# EAGLE design Serial_final_rev01 (EAGLE 9.6.0)
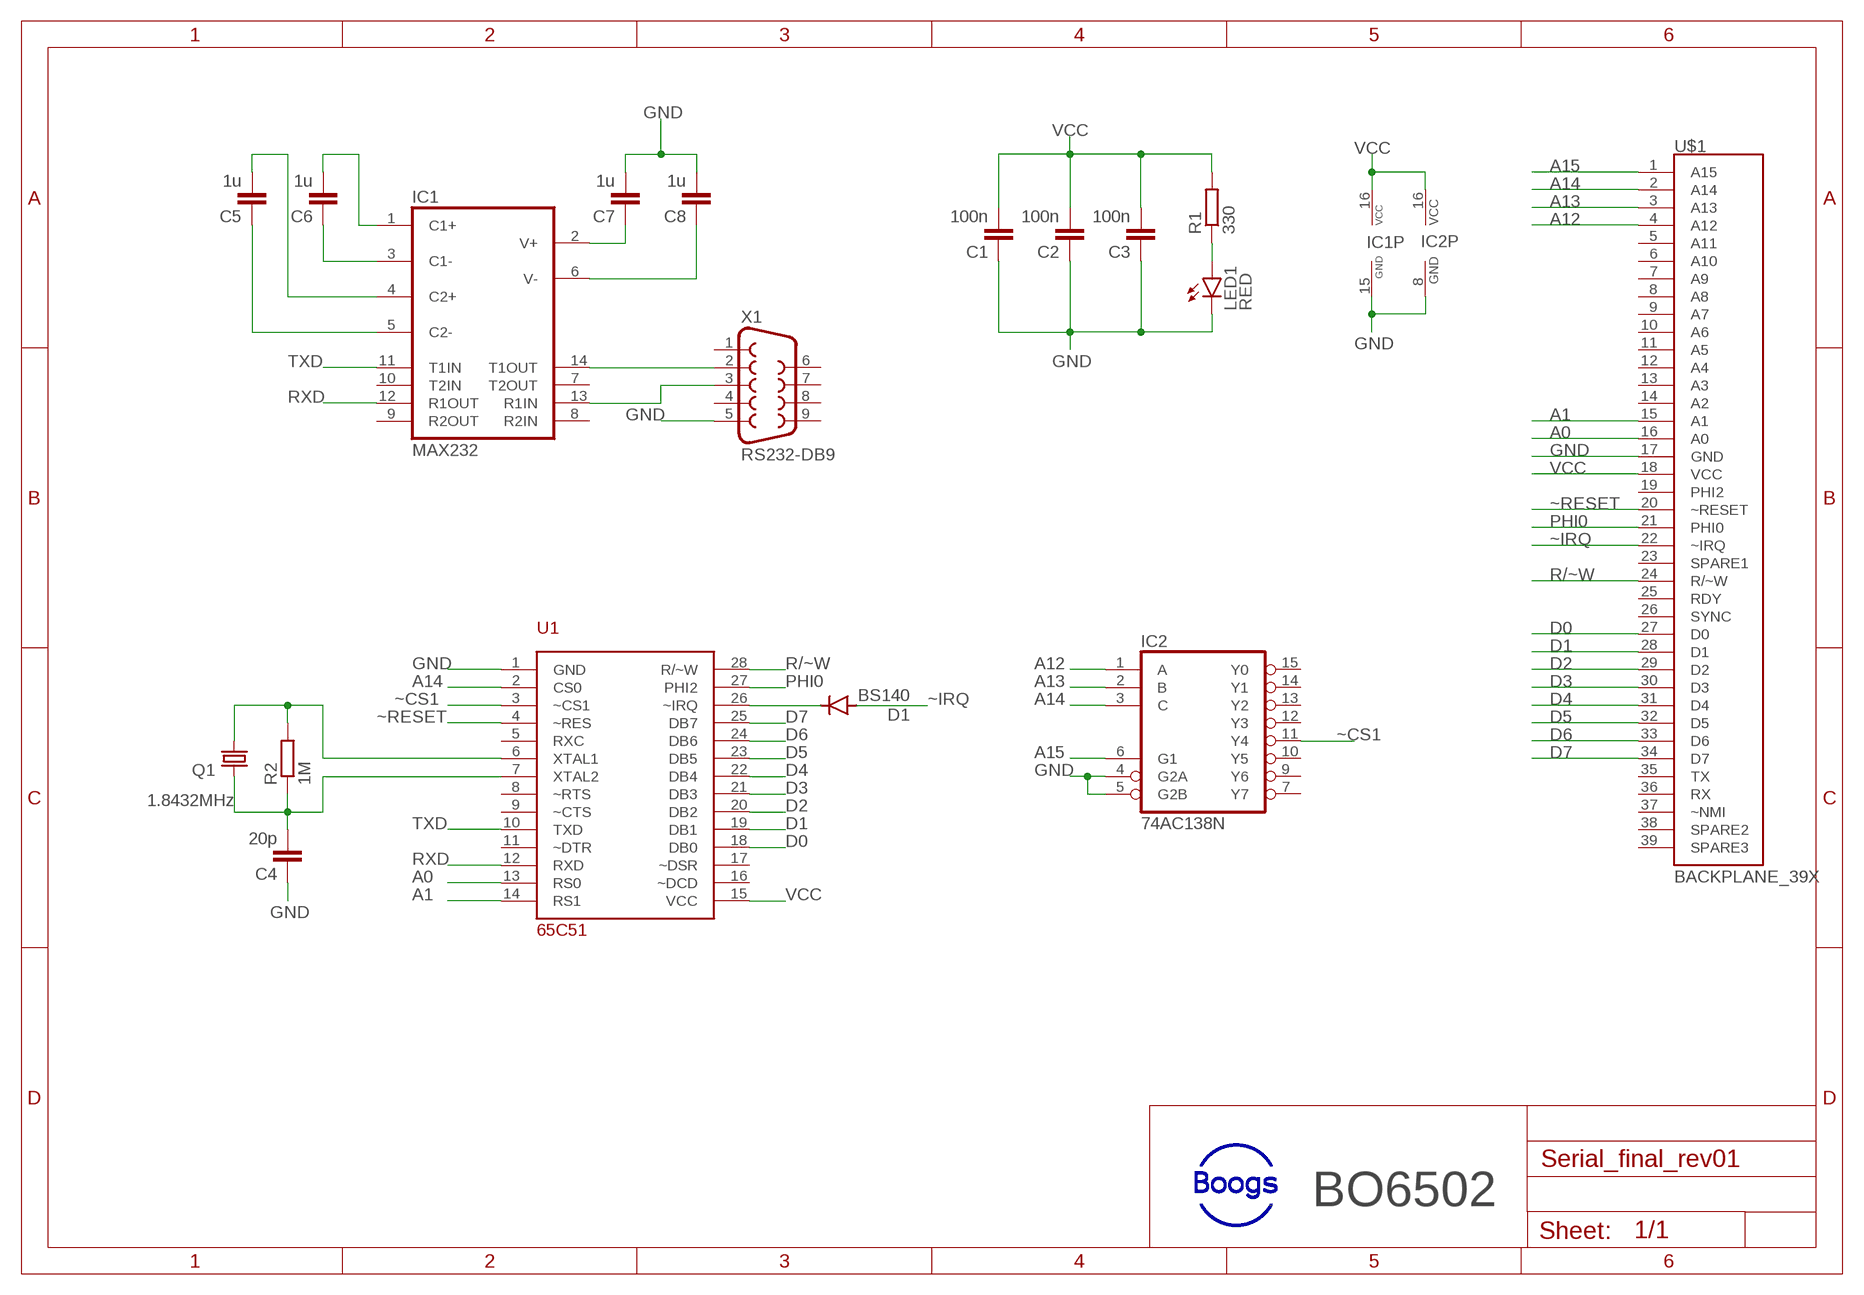
[diagram p0: schematic, sheet 1]

## Parts
C1  100n  C-EU025-025X050  [C025-025X050]
C2  100n  C-EU025-025X050  [C025-025X050]
C3  100n  C-EU025-025X050  [C025-025X050]
C4  20p  C-EU025-025X050  [C025-025X050]
C5  1u  C-EU050-025X075  [C050-025X075]
C6  1u  C-EU050-025X075  [C050-025X075]
C7  1u  C-EU050-025X075  [C050-025X075]
C8  1u  C-EU050-025X075  [C050-025X075]
D1  BS140  1N4004  [DO41-10]
IC1  MAX232  [DIL16]
IC2  74AC138N  [DIL16]
LED1  RED  LED5MM  [LED5MM]
Q1  1.8432MHz  CRYSTALHC49S  [HC49/S]
R1  330  R-EU_0207/10  [0207/10]
R2  1M  R-EU_0207/10  [0207/10]
U1  65C51  [DIL28]
U$1  BACKPLANE_39X  [BP_39X]
X1  RS232-DB9  F09HP  [F09HP]

## Nets
A0: U1.13(RS0) U$1.16(A0)
A1: U1.14(RS1) U$1.15(A1)
A12: IC2.1(A) U$1.4(A12)
A13: IC2.2(B) U$1.3(A13)
A14: IC2.3(C) U1.2(CS0) U$1.2(A14)
A15: IC2.6(G1) U$1.1(A15)
D0: U1.18(DB0) U$1.27(D0)
D1: U1.19(DB1) U$1.28(D1)
D2: U1.20(DB2) U$1.29(D2)
D3: U1.21(DB3) U$1.30(D3)
D4: U1.22(DB4) U$1.31(D4)
D5: U1.23(DB5) U$1.32(D5)
D6: U1.24(DB6) U$1.33(D6)
D7: U1.25(DB7) U$1.34(D7)
GND: C1.1 C2.1 C3.1 C4.1 C7.2 C8.2 IC1.15(GND) IC2.4(G2A) IC2.5(G2B) IC2.8(GND) LED1.K(C) U1.1(GND) U$1.17(GND) X1.5
N$1: C6.2 IC1.1(C1+)
N$2: D1.C U1.26(~IRQ)
N$3: C6.1 IC1.3(C1-)
N$4: C5.2 IC1.4(C2+)
N$5: C5.1 IC1.5(C2-)
N$6: LED1.A R1.1
N$7: IC1.14(T1OUT) X1.2
N$8: IC1.13(R1IN) X1.3
N$9: C7.1 IC1.2(V+)
N$10: C8.1 IC1.6(V-)
N$11: Q1.2 R2.2 U1.6(XTAL1)
N$12: C4.2 Q1.1 R2.1 U1.7(XTAL2)
PHI0: U1.27(PHI2) U$1.21(PHI0)
R/~W: U1.28(R/~W) U$1.24(R/~W)
RXD: IC1.12(R1OUT) U1.12(RXD)
TXD: IC1.11(T1IN) U1.10(TXD)
VCC: C1.2 C2.2 C3.2 IC1.16(VCC) IC2.16(VCC) R1.2 U1.15(VCC) U$1.18(VCC)
~CS1: IC2.11(Y4) U1.3(~CS1)
~IRQ: D1.A U$1.22(~IRQ)
~RESET: U1.4(~RES) U$1.20(~RESET)
Unconnected: IC1.7(T2OUT) IC1.8(R2IN) IC1.9(R2OUT) IC1.10(T2IN) IC2.7(Y7) IC2.9(Y6) IC2.10(Y5) IC2.12(Y3) IC2.13(Y2) IC2.14(Y1) IC2.15(Y0) U1.5(RXC) U1.8(~RTS) U1.9(~CTS) U1.11(~DTR) U1.16(~DCD) U1.17(~DSR) U$1.5(A11) U$1.6(A10) U$1.7(A9) U$1.8(A8) U$1.9(A7) U$1.10(A6) U$1.11(A5) U$1.12(A4) U$1.13(A3) U$1.14(A2) U$1.19(PHI2) U$1.23(SPARE1) U$1.25(RDY) U$1.26(SYNC) U$1.35(TX) U$1.36(RX) U$1.37(~NMI) U$1.38(SPARE2) U$1.39(SPARE3) X1.1 X1.4 X1.6 X1.7 X1.8 X1.9

## Notes on the sheet
- BO6502

## Library data of the parts
C1-C8 = rcl:C-EU: CAPACITOR, European symbol; SPICEPREFIX: C
D1 = diode:1N4004: DIODE general purpose rectifier, 1 A
IC1 = maxim:MAX232: RS232 TRANSCEIVER; MF: MAXIM; MPN: MAX232ACPE+; OC_FARNELL: 9723773; OC_NEWARK: 68K4544
IC2 = 74xx-eu:74*138: 3-line to 8-line DECODER/DEMULTIPLEXER
LED1 = led:LED: LED OSRAM: - CHIPLED LG R971, LG N971, LY N971, LG Q971, LY Q971, LO R971, LY R971 LH N974, LH R974 LS Q976, LO Q976, LY Q976 LO Q996 - Hyper CHIPLED LW Q18S LB Q993, LB Q99A, LB R99A - SideLED LS A670, LO A670, LY A670, LG A670, LP A670 LB A673, LV A673, LT A673, LW A673 LH A674 LY A675 LS A676, LA A676, LO A676, LY A676, LW A676 LS A679, LY A679, LG A679 - Hyper Micro SIDELED® LS Y876, LA Y876, LO Y876, LY Y876 LT Y87S - SmartLED LW L88C, LW L88S LB L89C, LB L89S, LG L890 LS L89K, LO L89K, LY L89K LS L896, LA L896, LO L896, LY L896 - TOPLED LS T670, LO T670, LY T670, LG T670, LP T670 LSG T670, LSP T670, LSY T670, LOP T670, LYG T670 LG T671, LOG T671, LSG T671 LB T673, LV T673, LT T673, LW T673 LH T674 LS T676, LA T676, LO T676, LY T676, LB T676, LH T676, LSB T676, LW T676 LB T67C, LV T67C, LT T67C, LS T67K, LO T67K, LY T67K, LW E67C LS E67B, LA E67B, LO E67B, LY E67B, LB E67C, LV E67C, LT E67C LW T67C LS T679, LY T679, LG T679 LS T770, LO T770, LY T770, LG T770, LP T770 LB T773, LV T773, LT T773, LW T773 LH T774 LS E675, LA E675, LY E675, LS T675 LS T776, LA T776, LO T776, LY T776, LB T776 LHGB T686 LT T68C, LB T68C - Hyper Mini TOPLED® LB M676 - Mini TOPLED Santana® LG M470 LS M47K, LO M47K, LY M47K Source: http://www.osram.convergy.de LUXEON: - LUMILED® LXK2-PW12-R00, LXK2-PW12-S00, LXK2-PW14-U00, LXK2-PW14-V00 LXK2-PM12-R00, LXK2-PM12-S00, LXK2-PM14-U00 LXK2-PE12-Q00, LXK2-PE12-R00, LXK2-PE12-S00, LXK2-PE14-T00, LXK2-PE14-U00 LXK2-PB12-K00, LXK2-PB12-L00, LXK2-PB12-M00, LXK2-PB14-N00, LXK2-PB14-P00, LXK2-PB14-Q00 LXK2-PR12-L00, LXK2-PR12-M00, LXK2-PR14-Q00, LXK2-PR14-R00 LXK2-PD12-Q00, LXK2-PD12-R00, LXK2-PD12-S00 LXK2-PH12-R00, LXK2-PH12-S00 LXK2-PL12-P00, LXK2-PL12-Q00, LXK2-PL12-R00 Source: www.luxeon.com KINGBRIGHT: KA-3528ASYC Source: www.kingbright.com
Q1 = crystal:CRYSTAL: CRYSTAL; OC_FARNELL: 1667008; OC_NEWARK: unknown
R1 R2 = rcl:R-EU_: RESISTOR, European symbol; SPICEPREFIX: R
U1 = 65xx_family:65C51
U$1 = 65xx_family:BACKPLANE_39X; A15: A15
X1 = con-subd:F09: SUB-D; OC_FARNELL: unknown; OC_NEWARK: unknown

## Board
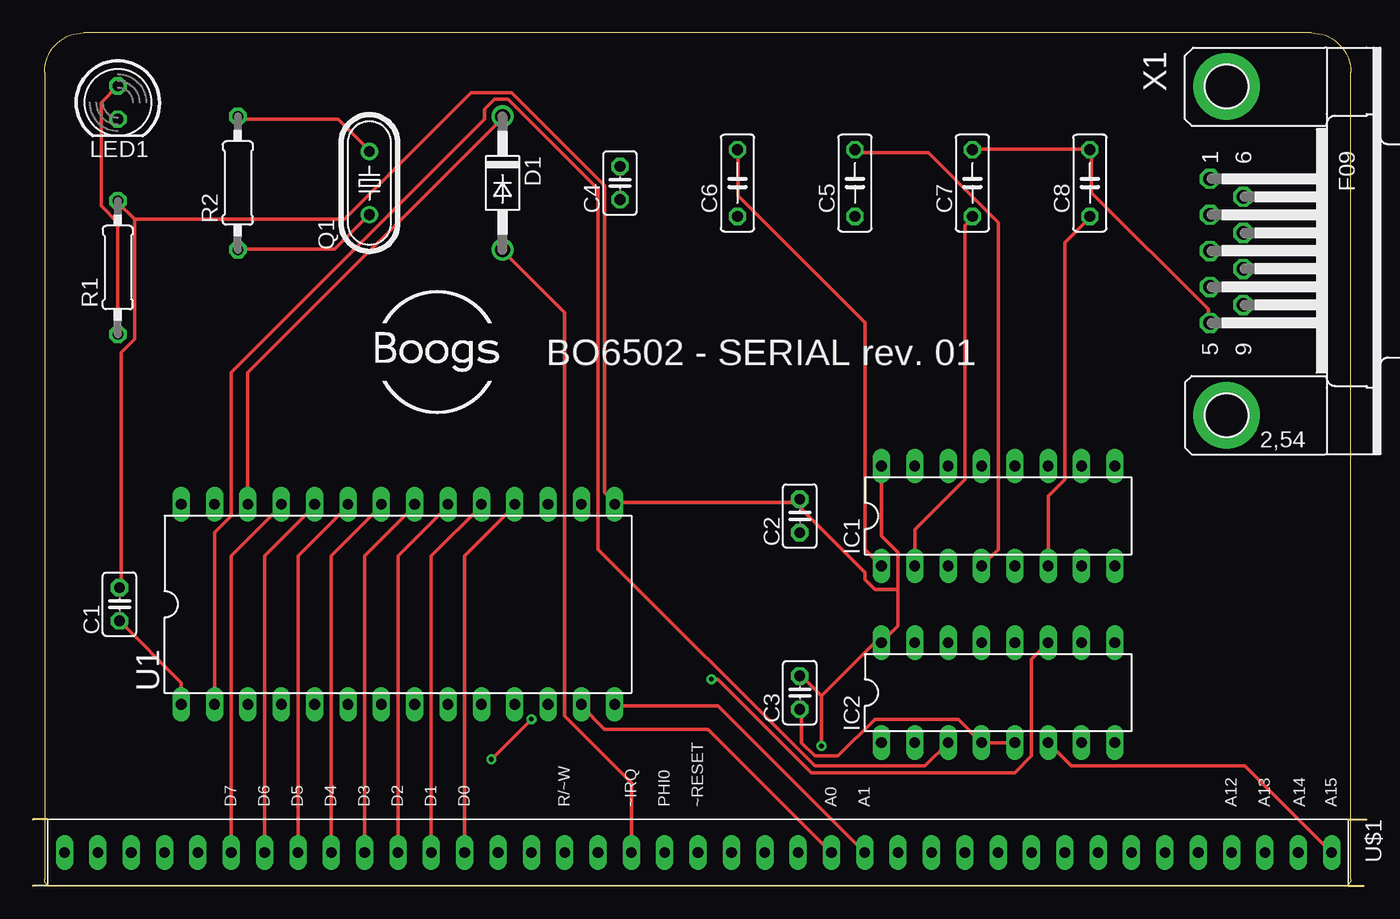
[diagram p1: board, top side]
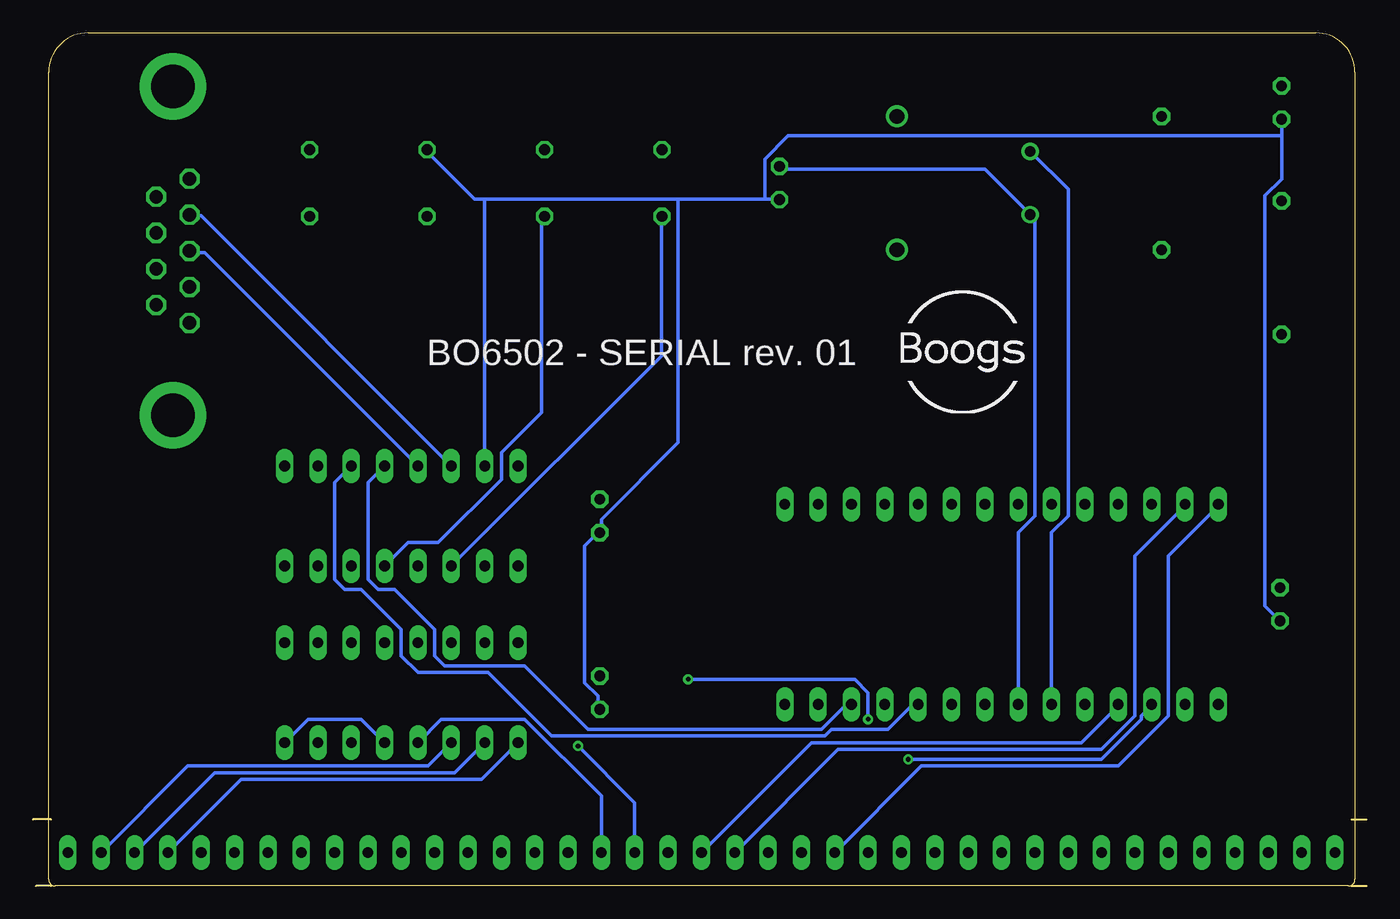
[diagram p2: board, bottom side, seen from below]

Size 101.6 x 65 mm. Coordinates in mm from the lower left corner, seen from the top.
Outline: 1.14,5.08 0,5.08
Outline: 1.14,0 0,0
Outline: 100.2,5.08 101.6,5.08
Outline: 100.2,0 101.35,0
Outline: 1.39,0 99.89,0 arc90 100.39,0.5 100.39,62 arc90 97.39,65 3.89,65 arc90 0.89,62 0.89,0.5 arc90 1.39,0
Copper layers (1*16): Top 0.035mm / dielectric 1.5mm / Bottom 0.035mm
Design rules "default *": minimum track width 10mil, minimum drill 0.35mm, track to track 10mil, track to pad 10mil, pad to pad 10mil, via to via 10mil, smd to smd 6mil, copper to edge 40mil, drill to drill 6mil, minimum pad ring 10mil, minimum via ring 8mil, stop-mask expansion 4mil, vias tented up to drill 15mil, thermal gap 10mil

### Footprints (pad centres in the part's own frame; a part is rotated, then mirrored left to right if it is on the bottom)
C025-025X050 = drill 0.813 octagon: 1 -1.27,0; 2 1.27,0
C050-025X075 = drill 0.813 octagon: 1 -2.54,0; 2 2.54,0
DO41-10 = drill 1.118: A 5.08,0; C -5.08,0
DIL16 = drill 0.813 long: 1 -8.89,-3.81; 2 -6.35,-3.81; 3 -3.81,-3.81; 4 -1.27,-3.81; 5 1.27,-3.81; 6 3.81,-3.81; 7 6.35,-3.81; 8 8.89,-3.81; 9 8.89,3.81; 10 6.35,3.81; 11 3.81,3.81; 12 1.27,3.81; 13 -1.27,3.81; 14 -3.81,3.81; 15 -6.35,3.81; 16 -8.89,3.81
LED5MM = drill 0.813 octagon: A -1.27,0; K 1.27,0
HC49/S = drill 0.813: 1 -2.413,0; 2 2.413,0
0207/10 = drill 0.813 octagon: 1 -5.08,0; 2 5.08,0
DIL28 = drill 0.813 long: 1 -16.51,-7.62; 2 -13.97,-7.62; 3 -11.43,-7.62; 4 -8.89,-7.62; 5 -6.35,-7.62; 6 -3.81,-7.62; 7 -1.27,-7.62; 8 1.27,-7.62; 9 3.81,-7.62; 10 6.35,-7.62; 11 8.89,-7.62; 12 11.43,-7.62; 13 13.97,-7.62; 14 16.51,-7.62; 15 16.51,7.62; 16 13.97,7.62; 17 11.43,7.62; 18 8.89,7.62; 19 6.35,7.62; 20 3.81,7.62; 21 1.27,7.62; 22 -1.27,7.62; 23 -3.81,7.62; 24 -6.35,7.62; 25 -8.89,7.62; 26 -11.43,7.62; 27 -13.97,7.62; 28 -16.51,7.62
BP_39X = drill 0.813 long: 1 1.27,59.69; 2 1.27,57.15; 3 1.27,54.61; 4 1.27,52.07; 5 1.27,49.53; 6 1.27,46.99; 7 1.27,44.45; 8 1.27,41.91; 9 1.27,39.37; 10 1.27,36.83; 11 1.27,34.29; 12 1.27,31.75; 13 1.27,29.21; 14 1.27,26.67; 15 1.27,24.13; 16 1.27,21.59; 17 1.27,19.05; 18 1.27,16.51; 19 1.27,13.97; 20 1.27,11.43; 21 1.27,8.89; 22 1.27,6.35; 23 1.27,3.81; 24 1.27,1.27; 25 1.27,-1.27; 26 1.27,-3.81; 27 1.27,-6.35; 28 1.27,-8.89; 29 1.27,-11.43; 30 1.27,-13.97; 31 1.27,-16.51; 32 1.27,-19.05; 33 1.27,-21.59; 34 1.27,-24.13; 35 1.27,-26.67; 36 1.27,-29.21; 37 1.27,-31.75; 38 1.27,-34.29; 39 1.27,-36.83
F09HP = drill 1.016 octagon: 1 -5.486,-1.27; 2 -2.743,-1.27; 3 0,-1.27; 4 2.743,-1.27; 5 5.486,-1.27; 6 -4.115,1.27; 7 -1.372,1.27; 8 1.372,1.27; 9 4.115,1.27 | drill 3.302 pad 5.08: G1 -12.522,0; G2 12.522,0

### Placement (x,y rotation side)
C1  6.6,21.46 90 top
C2  58.42,28.19 90 top
C3  58.42,14.73 90 top
C4  44.73,53.56 90 top
C5  62.62,53.56 90 top
C6  53.67,53.56 90 top
C7  71.57,53.56 90 top
C8  80.52,53.56 90 top
D1  35.78,53.56 270 top
IC1  73.53,28.19 0 top
IC2  73.53,14.73 0 top
LED1  6.48,59.69 270 top
Q1  25.64,53.56 90 top
R1  6.48,47.12 90 top
R2  15.62,53.56 90 top
U1  27.81,21.46 0 top
U$1  39.24,3.81 270 top
X1  90.93,48.39 270 top

### Tracks (layer width: path | path; a pad name or v marks a point on that pad's centre or on a via)
A0
  Top 0.254: U$1.16 51.44,11.94 43.56,11.94 41.78,13.72 U1.13
A1
  Top 0.254: U$1.15 52.2,13.72 44.32,13.72 U1.14
A12
  Bottom 0.254: U$1.4 85.72,8.13 67.44,8.13 IC2.1
A13
  Bottom 0.254: U$1.3 87.76,8.64 69.47,8.64 IC2.2
A14
  Top 0.254: U1.2 13.84,26.92 15.11,28.19 15.11,39.12 34.42,58.42 34.42,59.18 35.18,59.94 36.2,59.94 43.05,53.09 43.05,25.65 59.56,9.14 67.94,9.14 IC2.3
  Bottom 0.254: IC2.3 71.5,9.14 89.79,9.14 U$1.2
A15
  Top 0.254: U$1.1 92.33,9.14 79.12,9.14 IC2.6
D0
  Top 0.254: U$1.27 32.89,25.15 36.7,28.96 U1.18
D1
  Top 0.254: U$1.28 30.35,25.15 34.16,28.96 U1.19
D2
  Top 0.254: U$1.29 27.81,25.15 31.62,28.96 U1.20
D3
  Top 0.254: U$1.30 25.27,25.15 29.08,28.96 U1.21
D4
  Top 0.254: U$1.31 22.73,25.15 26.54,28.96 U1.22
D5
  Top 0.254: U$1.32 20.19,25.15 24,28.96 U1.23
D6
  Top 0.254: U$1.33 17.65,25.15 21.46,28.96 U1.24
D7
  Top 0.254: U$1.34 15.11,25.15 18.92,28.96 U1.25
GND
  Top 0.254: U1.1 11.3,15.49 C1.1 | IC2.5 IC2.4 70.48,12.7 64.14,12.7 61.34,9.91 59.56,9.91 58.55,10.92 58.55,13.46 C3.1 | C7.2 71.75,56.13 80.39,56.13 C8.2 80.64,55.88 80.64,52.83 89.53,43.94 89.53,42.93 X1.5
  Bottom 0.254: 6.48,57.15 6.48,53.85 7.75,52.58 7.75,21.34 C1.1 | 6.48,57.15 LED1.K | C3.1 58.55,13.46 58.55,14.48 59.56,15.49 59.56,25.91 58.55,26.92 C2.1 58.29,26.92 58.29,27.94 52.45,33.78 52.45,52.32 | U$1.17 58.29,6.86 64.14,12.7 70.48,12.7 IC2.4 | IC2.8 80.64,12.7 76.58,12.7 IC2.5 | 67.18,52.32 67.94,52.32 71.5,55.88 C7.2 | 67.18,52.32 52.45,52.32 | 52.45,52.32 45.85,52.32 | 45.85,52.32 44.83,52.32 C4.1 | 67.18,52.32 IC1.15 | 6.48,57.15 44.07,57.15 45.85,55.37 45.85,52.32
N$1
  Top 0.254: IC1.1 63.37,25.65 63.37,42.93 53.72,52.58 53.72,55.88 C6.2
N$2
  Top 0.254: U1.26 16.38,39.12 35.69,58.42 D1.C
N$3
  Bottom 0.254: IC1.3 53.72,40.39 53.72,50.8 C6.1
N$4
  Top 0.254: IC1.4 73.53,25.65 73.53,50.55 68.2,55.88 62.87,55.88 C5.2
N$5
  Bottom 0.254: IC1.5 73.02,26.16 70.74,26.16 65.91,30.99 65.91,33.02 62.87,36.07 62.87,50.8 C5.1
N$6
  Top 0.254: R1.1 6.48,50.55 5.21,51.82 5.21,59.69 LED1.A
N$7
  Bottom 0.254: IC1.14 88.77,51.05 89.53,51.05 X1.2
N$8
  Bottom 0.254: IC1.13 88.52,48.26 89.53,48.26 X1.3
N$9
  Top 0.254: IC1.2 67.18,27.18 70.99,30.99 70.99,50.29 71.5,50.8 C7.1
N$10
  Top 0.254: IC1.6 77.34,29.72 78.61,30.99 78.61,49.02 80.39,50.8 C8.1
N$11
  Top 0.254: R2.2 15.62,58.42 23.24,58.42 25.53,56.13 Q1.2
  Bottom 0.254: U1.6 24,26.92 22.73,28.19 22.73,53.09 25.53,55.88 Q1.2
N$12
  Top 0.254: R2.1 15.62,48.51 22.99,48.51 25.53,51.05 Q1.1
  Bottom 0.254: U1.7 26.54,26.92 25.27,28.19 25.27,50.8 25.53,51.05 Q1.1 25.78,51.31 29.08,54.61 44.58,54.61 C4.2
PHI0
  Bottom 0.254: U$1.21 40.26,10.41 20.19,10.41 17.65,12.95 17.65,25.15 13.84,28.96 U1.27
R/~W
  Bottom 0.254: U$1.24 33.91,9.14 18.92,9.14 15.11,12.95 15.11,25.15 11.3,28.96 U1.28
RXD
  Bottom 0.254: IC1.12 76.07,30.73 76.07,23.37 75.31,22.61 74.04,22.61 70.99,19.56 70.99,17.53 70.23,16.76 64.14,16.76 59.31,11.94 41.53,11.94 39.75,13.72 39.24,13.72 U1.12
TXD
  Bottom 0.254: IC1.11 78.61,30.73 78.61,23.37 77.85,22.61 76.58,22.61 73.53,19.56 73.53,17.53 72.26,16.26 66.93,16.26 62.1,11.43 41.28,11.43 40.77,11.94 36.45,11.94 34.67,13.72 34.16,13.72 U1.10
VCC  (via drill 0.35)
  Top 0.254: 7.75,50.8 7.75,41.66 6.73,40.64 6.73,22.86 C1.2 | 7.75,50.8 6.48,52.07 R1.2 | 58.04,29.21 44.32,29.21 | 58.04,29.21 58.29,29.46 C2.2 58.04,29.21 | 60.07,14.48 v60.07,10.67 | 60.07,14.48 58.55,16 C3.2 | 60.07,14.48 64.14,18.54 IC2.16 65.91,19.81 65.91,22.61 | IC1.16 64.64,26.67 65.91,25.4 65.91,22.61 | 58.04,29.21 63.37,23.88 63.37,23.37 64.14,22.61 65.91,22.61 | 7.75,50.8 23.75,50.8 33.4,60.45 36.45,60.45 43.56,53.34 43.56,29.97 44.32,29.21 | 44.32,29.21 U1.15
  Bottom 0.254: U$1.18 55.75,6.35 v60.07,10.67
~CS1  (via drill 0.35)
  Top 0.254: v37.97,12.7 v34.93,9.65 | v51.69,15.75 52.2,15.75 59.31,8.64 74.8,8.64 76.07,9.91 76.07,17.27 IC2.11
  Bottom 0.254: v34.93,9.65 20.19,9.65 17.14,12.7 17.14,12.95 16.38,13.72 U1.3 | v37.97,12.7 37.97,14.73 38.99,15.75 v51.69,15.75
~IRQ
  Top 0.254: U$1.22 45.59,7.87 40.51,12.95 40.51,43.69 35.94,48.26 D1.A
~RESET
  Bottom 0.254: U$1.20 42.29,10.92 21.72,10.92 18.92,13.72 U1.4

### Text on the board
tNames: BO6502 - SERIAL rev. 01 | D7 | D6 | D5 | D4 | D3 | D2 | D1 | D0 | R/~W | ~IRQ | PHI0 | ~RESET | A0 | A1 | A12 | A13 | A14 | A15
bNames: BO6502 - SERIAL rev. 01